# EAGLE design adaptateur relais Remora (EAGLE 7.4.0)
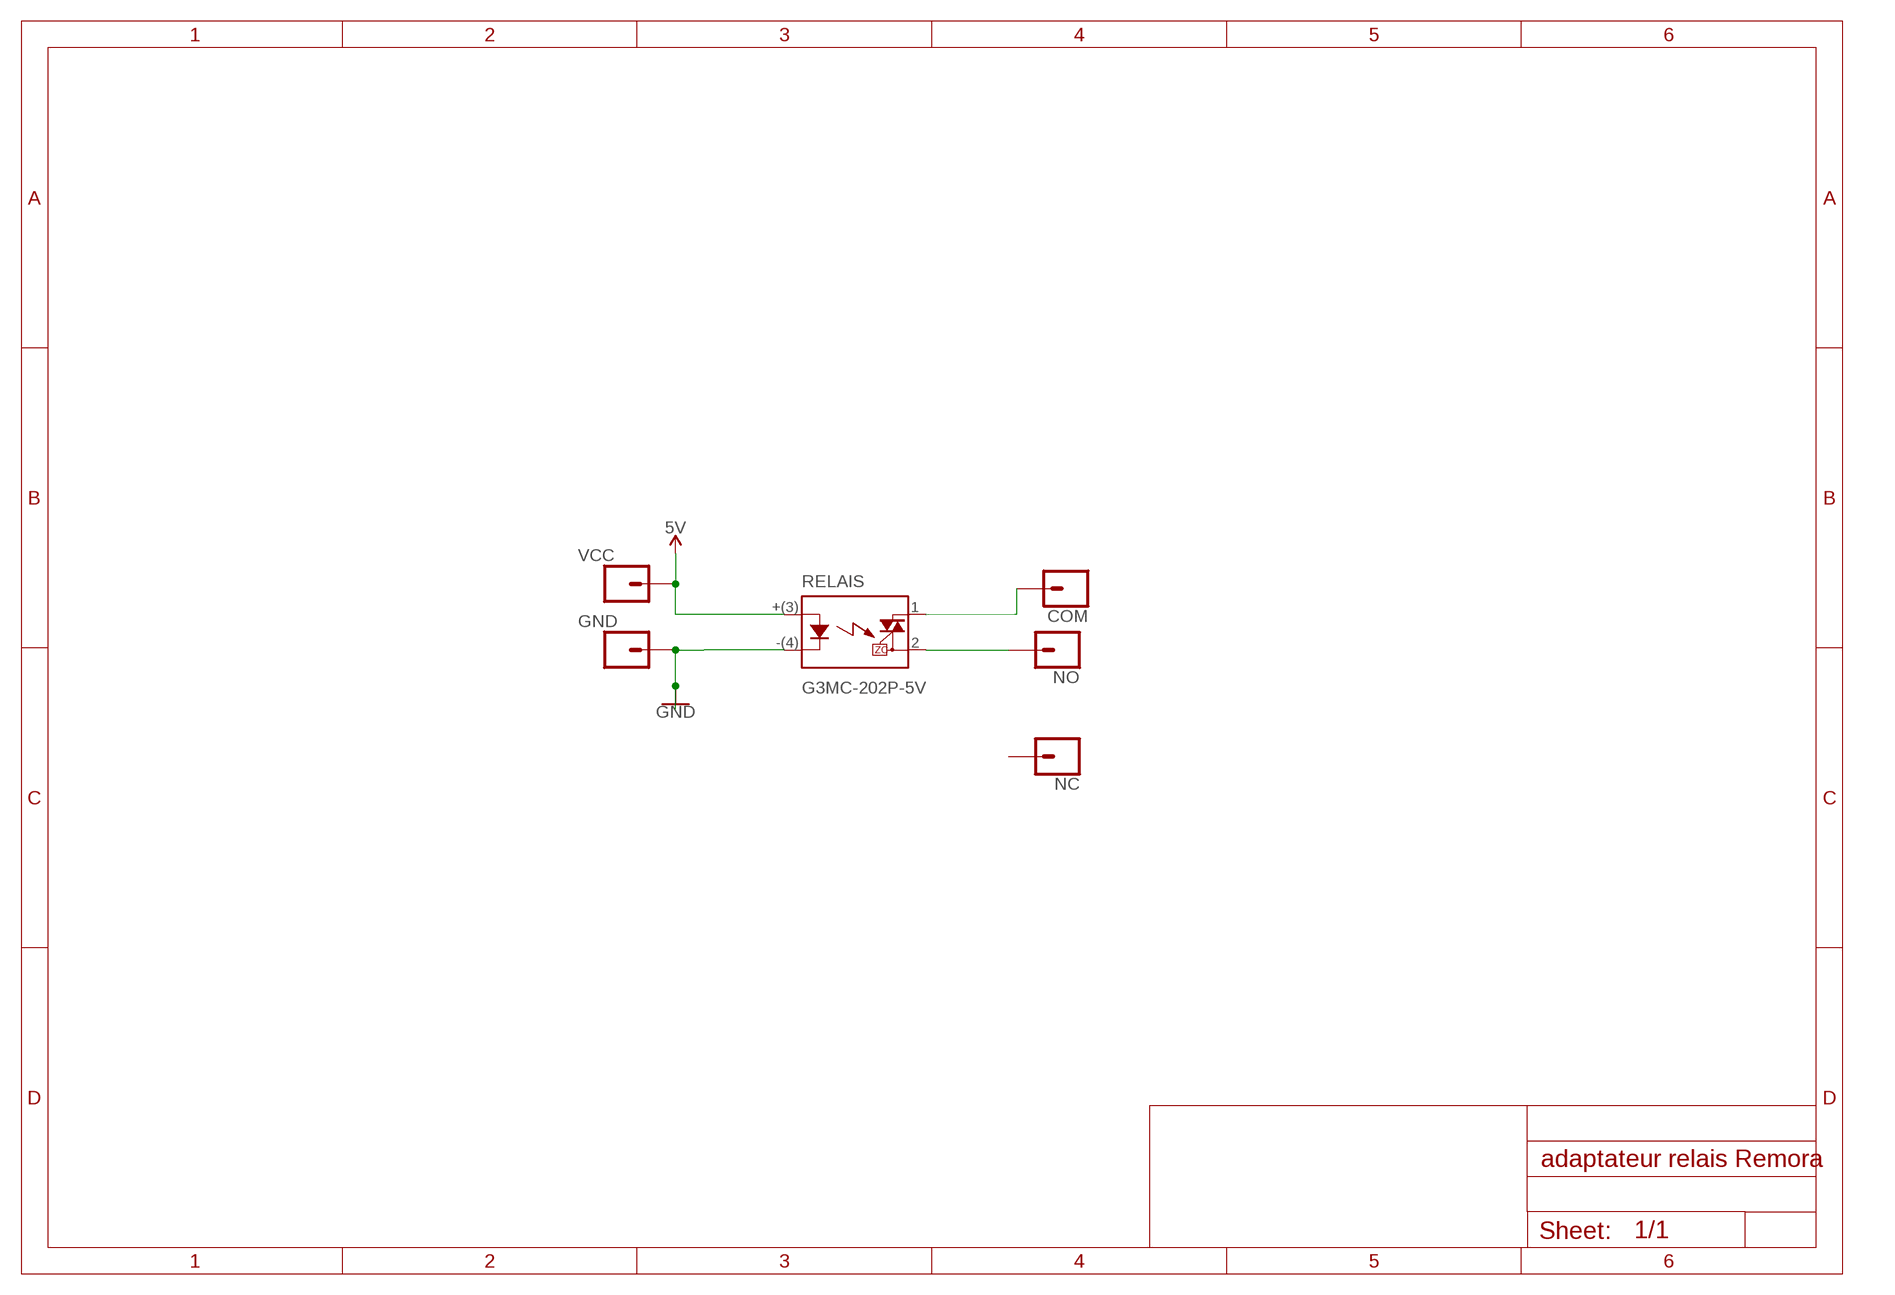
[diagram p0: schematic, sheet 1]

## Parts
COM  CONN_01  [1X01]
GND  CONN_01  [1X01]
NC  CONN_01  [1X01]
NO  CONN_01  [1X01]
RELAIS  G3MC-202P-5V  G3MC-202P  [SIP-4]
VCC  CONN_01  [1X01]

## Nets
5V: RELAIS.+(3) VCC.1
GND: GND.1 RELAIS.-(4)
N$2: COM.1 RELAIS.1
NO: NO.1 RELAIS.2
Unconnected: NC.1

## Library data of the parts
COM GND NC NO VCC = SparkFun-Connectors:CONN_01: Single connection point. Often used as Generic Header-pin footprint for 0.1 inch spaced/style header connections On any of the 0.1 inch spaced packages, you can populate with these: Break Away Headers - Straight <https://www.sparkfun.com/products/116> (PRT-00116) Break Away Male Headers - Right Angle <https://www.sparkfun.com/products/553> (PRT-00553) Female Headers <https://www.sparkfun.com/products/115> (PRT-00115) Break Away Headers - Machine Pin <https://www.sparkfun.com/products/117> (PRT-00117) Break Away Female Headers - Swiss Machine Pin <https://www.sparkfun.com/products/743> (PRT-00743) This device is also useful as a general connection point to wire up your design to another part of your project. Our various solder wires solder well into these plated through hole pads. Hook-Up Wire - Assortment (Stranded, 22 AWG) <https://www.sparkfun.com/products/11375> (PRT-11375) Hook-Up Wire - Assortment (Solid Core, 22 AWG) <https://www.sparkfun.com/products/11367> (PRT-11367) View the entire wire category on our website here <https://www.sparkfun.com/categories/141> Special notes: SMTSO-256-ET is a "flush mount" nut for a 4-40 screw. We mostly use this on specialty testbeds; it is a nice way to connect hardware to your PCB at an adjustable hieght. Also note, the SNAP packages are for using a snappable style connector. We sell a baggie of snaps and they are also used on two LilyPad designs: Snap Assortment - 30 pack (male and female) <https://www.sparkfun.com/products/11347> (DEV-11347) LilyPad Arduino SimpleSnap <https://www.sparkfun.com/products/10941> (DEV-10941) LilyPad SimpleSnap Protoboard <https://www.sparkfun.com/products/10940> (DEV-10940)
RELAIS = sip-4:G3MC-202P

## Board
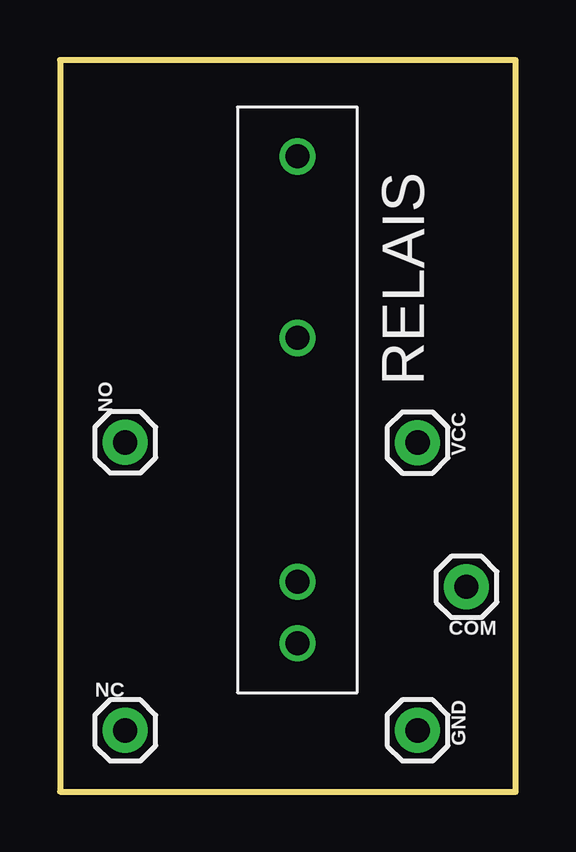
[diagram p1: board, top side]
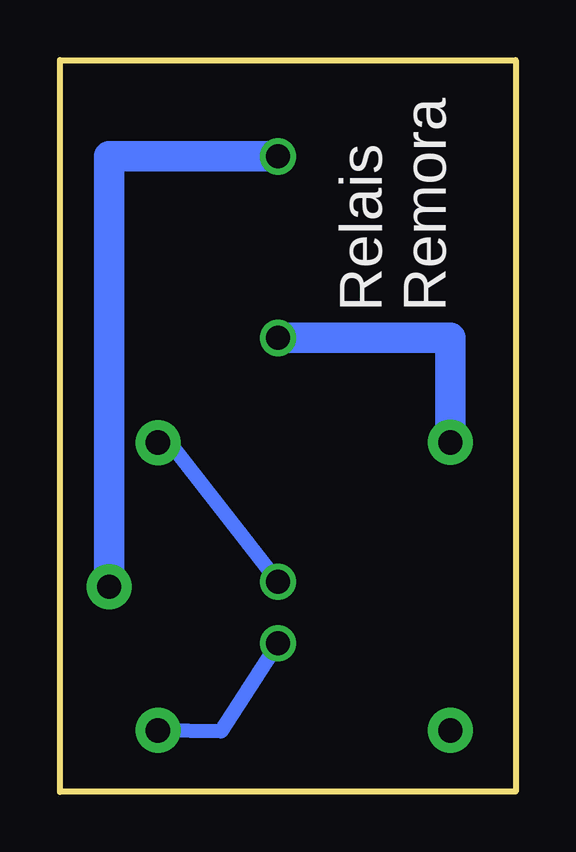
[diagram p2: board, bottom side, seen from below]

Size 19 x 30.49 mm. Coordinates in mm from the lower left corner, seen from the top.
Outline: 0,0.01 19,0 19,30.48 0,30.49 0,0.01
Copper layers (1*16): Top 0.035mm / dielectric 1.5mm / Bottom 0.035mm
Design rules "default": minimum track width 10mil, minimum drill 24mil, track to track 8mil, track to pad 8mil, pad to pad 8mil, via to via 8mil, smd to smd 8mil, copper to edge 40mil, drill to drill 8mil, minimum pad ring 10mil, minimum via ring 8mil, stop-mask expansion 4mil, vias tented up to drill 0mil, thermal gap 10mil

### Footprints (pad centres in the part's own frame; a part is rotated, then mirrored left to right if it is on the bottom)
1X01 = drill 1.016 pad 1.88: 1 0,0
SIP-4 = drill 1: 1 10.1,-0.04; 2 2.54,-0.04; +(3) -7.62,-0.04; -(4) -10.18,-0.04

### Placement (x,y rotation side)
COM  16.95,8.54 180 top
GND  14.91,2.56 270 top
NC  2.72,2.56 0 top
NO  2.72,14.56 270 top
RELAIS  9.86,16.37 90 top
VCC  14.91,14.55 270 top

### Tracks (layer width: path | path; a pad name or v marks a point on that pad's centre or on a via)
5V
  Bottom 0.61: VCC.1 14.43,14.55 RELAIS.+(3)
GND
  Bottom 0.61: GND.1 12.29,2.53 RELAIS.-(4)
N$2
  Bottom 1.27: RELAIS.1 16.95,26.47 COM.1
NO
  Bottom 1.27: NO.1 2.72,18.91 RELAIS.2

### Text on the board
bNames: Relais / Remora